# Altium schematic sheet Headers.SchDoc
size A4
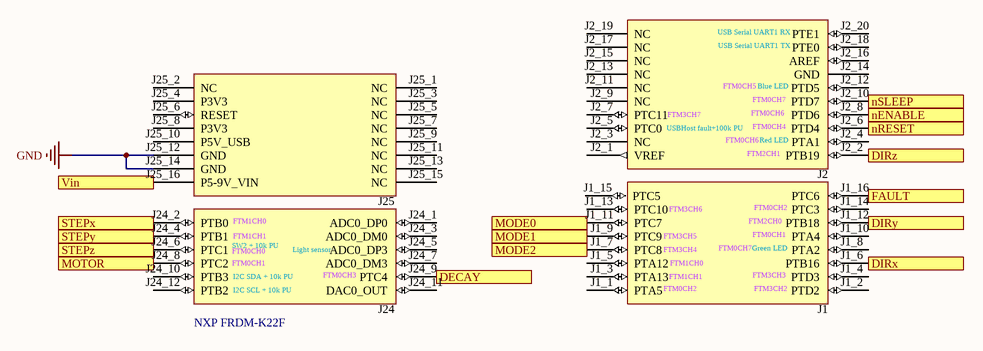
[diagram p0: Headers.SchDoc]

## Parts
*  NXP FRDM-K22F  [FRDM-K22F]

## Ports
DECAY (out), DIRx (out), DIRy (out), DIRz (out), FAULT (in), MODE0 (out), MODE1 (out), MODE2 (out), MOTOR (out), nENABLE (out), nRESET (out), nSLEEP (out), STEPx (out), STEPy (out), STEPz (out), Vin (in)

## Nets
GND: *.J25_12(GND) *.J25_14(GND)
DECAY: *.J24_9(PTC4) ; port DECAY
DIRx: *.J1_6(PTB16) ; port DIRx
DIRy: *.J1_12(PTB18) ; port DIRy
DIRz: *.J2_2(PTB19) ; port DIRz
FAULT: *.J1_16(PTC6) ; port FAULT
MODE0: *.J1_11(PTC7) ; port MODE0
MODE1: *.J1_9(PTC9) ; port MODE1
MODE2: *.J1_7(PTC8) ; port MODE2
MOTOR: *.J24_8(PTC2) ; port MOTOR
nENABLE: *.J2_8(PTD6) ; port nENABLE
nRESET: *.J2_6(PTD4) ; port nRESET
nSLEEP: *.J2_10(PTD7) ; port nSLEEP
STEPx: *.J24_2(PTB0) ; port STEPx
STEPy: *.J24_4(PTB1) ; port STEPy
STEPz: *.J24_6(PTC1) ; port STEPz
Vin: *.J25_16(P5-9V_VIN) ; port Vin

Not connected (* = marked no-connect by the designer): * J1_1(PTA5) J1_2(PTD2) J1_3(PTA13) J1_4(PTD3) J1_5(PTA12) J1_8(PTA2) J1_10(PTA4) J1_13(PTC10) J1_14(PTC3) J1_15(PTC5) J2_1(VREF) J2_3(NC) J2_4(PTA1) J2_5(PTC0) J2_7(PTC11) J2_9(NC) J2_11(NC) J2_12(PTD5) J2_13(NC) J2_14(GND) J2_15(NC) J2_16(AREF) J2_17(NC) J2_18(PTE0) J2_19(NC) J2_20(PTE1) J24_1(ADC0_DP0) J24_3(ADC0_DM0) J24_5(ADC0_DP3) J24_7(ADC0_DM3) J24_10(PTB3) J24_11(DAC0_OUT) J24_12(PTB2) J25_1(NC) J25_2(NC) J25_3(NC) J25_4(P3V3) J25_5(NC) J25_6(RESET) J25_7(NC) J25_8(P3V3) J25_9(NC) J25_10(P5V_USB) J25_11(NC) J25_13(NC) J25_15(NC)

## Notes on the sheet
- Date:
- Sheet
- of
- Time:
- Revision:
- Drawn by:
- File:
- (in symbol NXP FRDM-K22F) USB Serial UART1 RX; USB Serial UART1 TX; FTM0CH5; Blue LED; FTM0CH7; FTM3CH7; FTM0CH6; USBHost fault+100k PU; FTM0CH4; Red LED; FTM2CH1; J2; J25; FTM3CH6; FTM0CH2; FTM1CH0; FTM2CH0; FTM1CH1; FTM3CH5; FTM0CH1; SW2 + 10k PU; FTM0CH0; Light sensor; FTM3CH4; Green LED; I2C SDA + 10k PU; FTM0CH3; FTM3CH3; I2C SCL + 10k PU; FTM3CH2; J24; J1